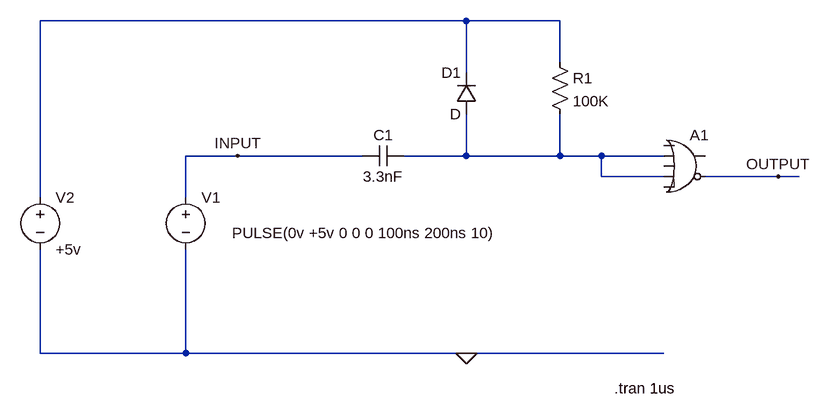
[diagram p0: schematic Prototype 3.asc]
Prototype 3.asc, the LTspice schematic file:
Version 4
SHEET 1 880 680
WIRE 224 -32 -432 -32
WIRE 368 -32 224 -32
WIRE 368 32 368 -32
WIRE 224 48 224 -32
WIRE -128 176 -208 176
WIRE 64 176 -128 176
WIRE 224 176 224 112
WIRE 224 176 128 176
WIRE 368 176 368 112
WIRE 368 176 224 176
WIRE 432 176 368 176
WIRE 528 176 432 176
WIRE 432 208 432 176
WIRE 528 208 432 208
WIRE 704 208 592 208
WIRE 736 208 704 208
WIRE -432 240 -432 -32
WIRE -208 240 -208 176
WIRE -432 480 -432 320
WIRE -208 480 -208 320
WIRE -208 480 -432 480
WIRE 224 480 -208 480
WIRE 528 480 224 480
FLAG 224 480 0
FLAG -128 176 INPUT
FLAG 704 208 OUTPUT
SYMBOL voltage -208 224 R0
WINDOW 3 71 71 Left 2
WINDOW 123 0 0 Left 0
WINDOW 39 0 0 Left 0
SYMATTR InstName V1
SYMATTR Value PULSE(0v +5v 0 0 0 100ns 200ns 10)
SYMBOL cap 128 160 R90
WINDOW 0 0 32 VBottom 2
WINDOW 3 32 32 VTop 2
SYMATTR InstName C1
SYMATTR Value 3.3nF
SYMBOL Digital\\or 560 128 R0
SYMATTR InstName A1
SYMATTR SpiceLine Vhigh=+5V
SYMATTR SpiceLine2 Trise=7ns Td=11ns
SYMBOL voltage -432 224 R0
WINDOW 123 0 0 Left 0
WINDOW 39 0 0 Left 0
SYMATTR InstName V2
SYMATTR Value +5v
SYMBOL diode 240 112 R180
WINDOW 0 24 64 Left 2
WINDOW 3 24 0 Left 2
SYMATTR InstName D1
SYMBOL res 352 16 R0
SYMATTR InstName R1
SYMATTR Value 100K
TEXT 452 534 Left 2 !.tran 1us

The netlist it stands for:
* Prototype 3.asc
V1 INPUT 0 PULSE(0v +5v 0 0 0 100ns 200ns 10)
C1 N002 INPUT 3.3nF
A1 0 N002 0 N002 0 OUTPUT 0 0 OR Vhigh=+5V Trise=7ns Td=11ns
V2 N001 0 +5v
D1 N002 N001 D
R1 N001 N002 100K
.model D D
.lib standard.dio
.tran 1us
.backanno
.end